# Altium project BMS Slave Device R1.5.PrjPcb
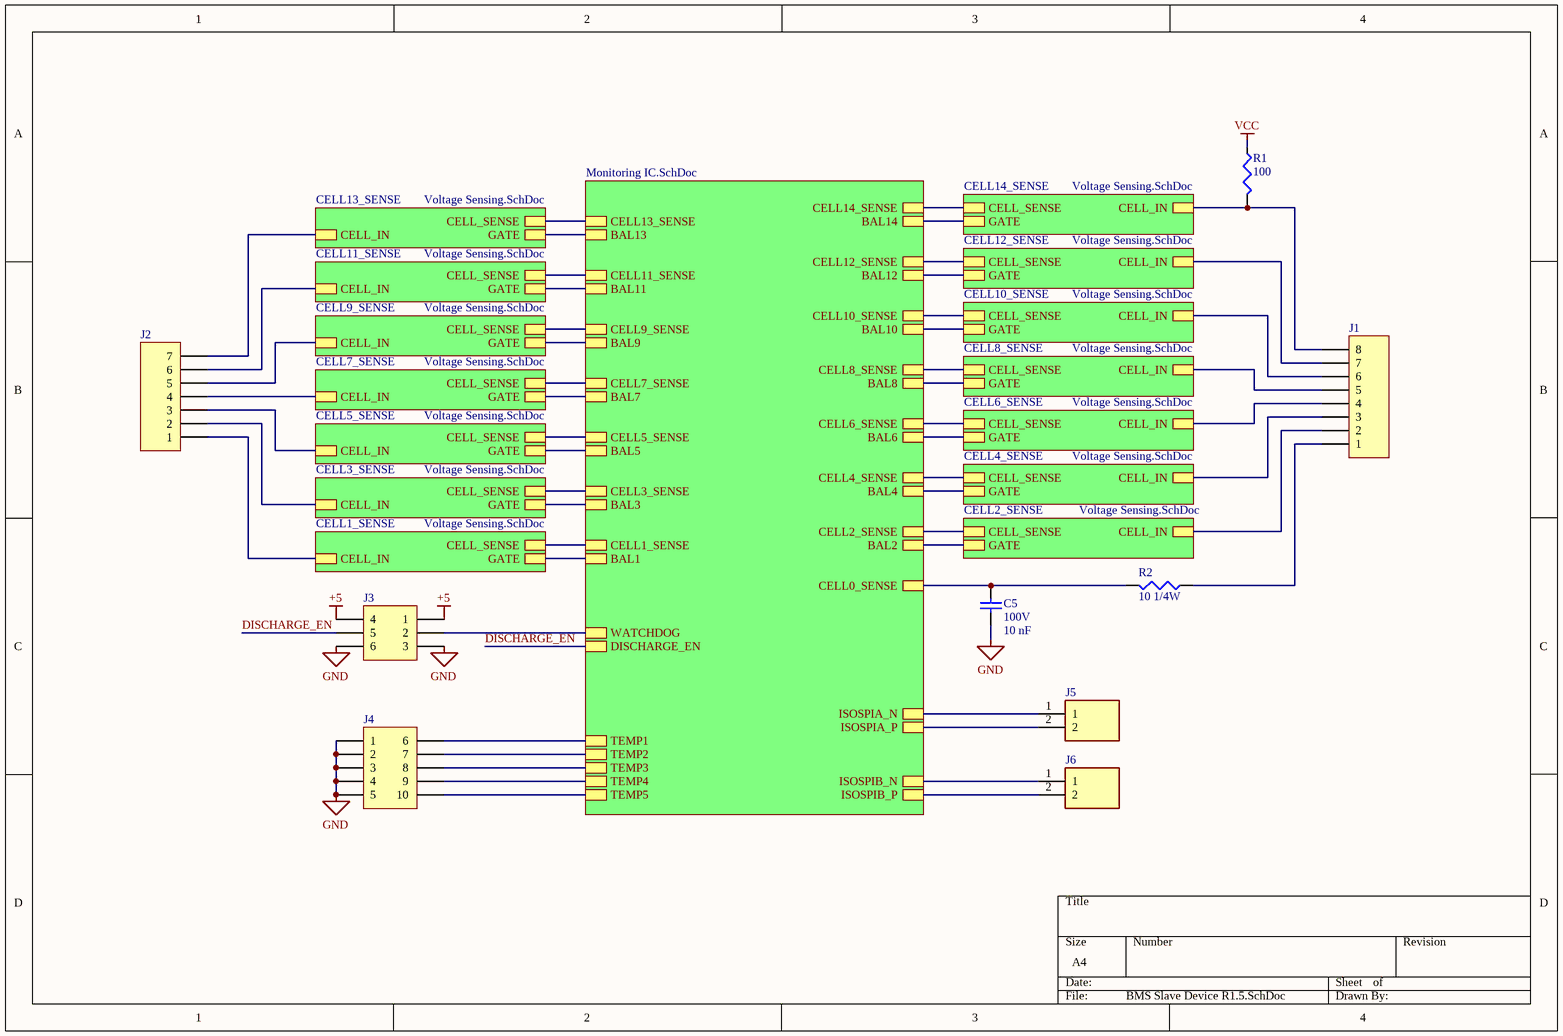
[diagram p0: BMS Slave Device R1.5.SchDoc]
3 sheets, 91 parts. Net scope: hierarchical (ports join the sheet entries above them; power ports are global).
Board file: BMS Slave Device R1.5.PcbDoc
Sheets:
  BMS Slave Device R1.5.SchDoc
    Designator = Monitoring IC.SchDoc
    CELL14_SENSE = Voltage Sensing.SchDoc
    CELL12_SENSE = Voltage Sensing.SchDoc
    CELL10_SENSE = Voltage Sensing.SchDoc
    CELL8_SENSE = Voltage Sensing.SchDoc
    CELL6_SENSE = Voltage Sensing.SchDoc
    CELL4_SENSE = Voltage Sensing.SchDoc
    CELL2_SENSE = Voltage Sensing.SchDoc
    CELL13_SENSE = Voltage Sensing.SchDoc
    CELL11_SENSE = Voltage Sensing.SchDoc
    CELL9_SENSE = Voltage Sensing.SchDoc
    CELL7_SENSE = Voltage Sensing.SchDoc
    CELL5_SENSE = Voltage Sensing.SchDoc
    CELL3_SENSE = Voltage Sensing.SchDoc
    CELL1_SENSE = Voltage Sensing.SchDoc

## Sheet BMS Slave Device R1.5.SchDoc
size A4

### Parts
C5  100V  100V: 10 nF  [6-0805_N]
J1  Header 8  [HDR1X8]  (value not drawn)
J2  ODD CELLS  [HDR1X7]  (value not drawn)
J3  (no value)  [HDR2X3_CEN]
J4  THERMISTORS  [HDR2X5_CEN]  (value not drawn)
J5  B2B-XH-2__LF__SN_  [B2BXH2LFSN]  (value not drawn)
J6  B2B-XH-2__LF__SN_  [B2BXH2LFSN]  (value not drawn)
R1  value 100  [J1-0603]  (hidden comment: Res3)
R2  value 10 1/4W  [C1206]

### Sub-sheets
CELL1_SENSE = Voltage Sensing.SchDoc: CELL_SENSE, CELL_IN, GATE
CELL2_SENSE = Voltage Sensing.SchDoc: CELL_SENSE, CELL_IN, GATE
CELL3_SENSE = Voltage Sensing.SchDoc: CELL_SENSE, CELL_IN, GATE
CELL4_SENSE = Voltage Sensing.SchDoc: CELL_SENSE, CELL_IN, GATE
CELL5_SENSE = Voltage Sensing.SchDoc: CELL_SENSE, CELL_IN, GATE
CELL6_SENSE = Voltage Sensing.SchDoc: CELL_SENSE, CELL_IN, GATE
CELL7_SENSE = Voltage Sensing.SchDoc: CELL_SENSE, CELL_IN, GATE
CELL8_SENSE = Voltage Sensing.SchDoc: CELL_SENSE, CELL_IN, GATE
CELL9_SENSE = Voltage Sensing.SchDoc: CELL_SENSE, CELL_IN, GATE
CELL10_SENSE = Voltage Sensing.SchDoc: CELL_SENSE, CELL_IN, GATE
CELL11_SENSE = Voltage Sensing.SchDoc: CELL_SENSE, CELL_IN, GATE
CELL12_SENSE = Voltage Sensing.SchDoc: CELL_SENSE, CELL_IN, GATE
CELL13_SENSE = Voltage Sensing.SchDoc: CELL_SENSE, CELL_IN, GATE
CELL14_SENSE = Voltage Sensing.SchDoc: CELL_SENSE, CELL_IN, GATE
Designator = Monitoring IC.SchDoc: CELL14_SENSE, BAL14, CELL13_SENSE, BAL13, CELL12_SENSE, BAL12, CELL11_SENSE, BAL11, CELL10_SENSE, BAL10, CELL9_SENSE, BAL9, CELL8_SENSE, BAL8, CELL7_SENSE, BAL7, CELL6_SENSE, BAL6, CELL5_SENSE, BAL5, CELL4_SENSE, BAL4, CELL3_SENSE, BAL3, BAL2, CELL2_SENSE, CELL1_SENSE, BAL1, TEMP3, TEMP4, TEMP2, TEMP1, TEMP5, CELL0_SENSE, WATCHDOG, DISCHARGE_EN, ISOSPIA_N, ISOSPIB_P, ISOSPIB_N, ISOSPIA_P

### Nets
+5: J3.1 J3.4
GND: C5.1 J3.3 J3.6 J4.1 J4.2 J4.3 J4.4 J4.5
VCC: R1.2
DISCHARGE_EN: J3.5 ; sheet Designator/DISCHARGE_EN
NetC4A_2: sheet Designator/CELL1_SENSE, sheet CELL1_SENSE/CELL_SENSE
NetC4B_2: sheet Designator/CELL2_SENSE, sheet CELL2_SENSE/CELL_SENSE
NetC4C_2: sheet Designator/CELL3_SENSE, sheet CELL3_SENSE/CELL_SENSE
NetC4D_2: sheet Designator/CELL4_SENSE, sheet CELL4_SENSE/CELL_SENSE
NetC4E_2: sheet Designator/CELL5_SENSE, sheet CELL5_SENSE/CELL_SENSE
NetC4F_2: sheet Designator/CELL6_SENSE, sheet CELL6_SENSE/CELL_SENSE
NetC4G_2: sheet Designator/CELL7_SENSE, sheet CELL7_SENSE/CELL_SENSE
NetC4H_2: sheet Designator/CELL8_SENSE, sheet CELL8_SENSE/CELL_SENSE
NetC4I_2: sheet Designator/CELL9_SENSE, sheet CELL9_SENSE/CELL_SENSE
NetC4J_2: sheet Designator/CELL10_SENSE, sheet CELL10_SENSE/CELL_SENSE
NetC4K_2: sheet Designator/CELL11_SENSE, sheet CELL11_SENSE/CELL_SENSE
NetC4L_2: sheet Designator/CELL12_SENSE, sheet CELL12_SENSE/CELL_SENSE
NetC4M_2: sheet Designator/CELL13_SENSE, sheet CELL13_SENSE/CELL_SENSE
NetC4N_2: sheet Designator/CELL14_SENSE, sheet CELL14_SENSE/CELL_SENSE
NetC5_2: C5.2 R2.1 ; sheet Designator/CELL0_SENSE
NetD1A_2: sheet Designator/BAL1, sheet CELL1_SENSE/GATE
NetD1B_2: sheet Designator/BAL2, sheet CELL2_SENSE/GATE
NetD1C_2: sheet Designator/BAL3, sheet CELL3_SENSE/GATE
NetD1D_2: sheet Designator/BAL4, sheet CELL4_SENSE/GATE
NetD1E_2: sheet Designator/BAL5, sheet CELL5_SENSE/GATE
NetD1F_2: sheet Designator/BAL6, sheet CELL6_SENSE/GATE
NetD1G_2: sheet Designator/BAL7, sheet CELL7_SENSE/GATE
NetD1H_2: sheet Designator/BAL8, sheet CELL8_SENSE/GATE
NetD1I_2: sheet Designator/BAL9, sheet CELL9_SENSE/GATE
NetD1J_2: sheet Designator/BAL10, sheet CELL10_SENSE/GATE
NetD1K_2: sheet Designator/BAL11, sheet CELL11_SENSE/GATE
NetD1L_2: sheet Designator/BAL12, sheet CELL12_SENSE/GATE
NetD1M_2: sheet Designator/BAL13, sheet CELL13_SENSE/GATE
NetD1N_2: sheet Designator/BAL14, sheet CELL14_SENSE/GATE
NetJ1_1: J1.1 R2.2
NetJ1_2: J1.2 ; sheet CELL2_SENSE/CELL_IN
NetJ1_3: J1.3 ; sheet CELL4_SENSE/CELL_IN
NetJ1_4: J1.4 ; sheet CELL6_SENSE/CELL_IN
NetJ1_5: J1.5 ; sheet CELL8_SENSE/CELL_IN
NetJ1_6: J1.6 ; sheet CELL10_SENSE/CELL_IN
NetJ1_7: J1.7 ; sheet CELL12_SENSE/CELL_IN
NetJ1_8: J1.8 R1.1 ; sheet CELL14_SENSE/CELL_IN
NetJ2_1: J2.1 ; sheet CELL1_SENSE/CELL_IN
NetJ2_2: J2.2 ; sheet CELL3_SENSE/CELL_IN
NetJ2_3: J2.3 ; sheet CELL5_SENSE/CELL_IN
NetJ2_4: J2.4 ; sheet CELL7_SENSE/CELL_IN
NetJ2_5: J2.5 ; sheet CELL9_SENSE/CELL_IN
NetJ2_6: J2.6 ; sheet CELL11_SENSE/CELL_IN
NetJ2_7: J2.7 ; sheet CELL13_SENSE/CELL_IN
NetJ3_2: J3.2 ; sheet Designator/WATCHDOG
NetJ4_6: J4.6 ; sheet Designator/TEMP1
NetJ4_7: J4.7 ; sheet Designator/TEMP2
NetJ4_8: J4.8 ; sheet Designator/TEMP3
NetJ4_9: J4.9 ; sheet Designator/TEMP4
NetJ4_10: J4.10 ; sheet Designator/TEMP5
NetJ5_1: J5.1 ; sheet Designator/ISOSPIA_N
NetJ5_2: J5.2 ; sheet Designator/ISOSPIA_P
NetJ6_1: J6.1 ; sheet Designator/ISOSPIB_N
NetJ6_2: J6.2 ; sheet Designator/ISOSPIB_P

### Library data of the parts
C5 = Cap: Capacitor; Published: 8-Jun-2000; LatestRevisionDate: 17-Jul-2002; LatestRevisionNote: Re-released for DXP Platform.; PackageReference: RAD-0.3; Publisher: Altium Limited; PackageDescription: Radial Cap, Thru-Hole; 2 Leads; 0.3 in Pin Spacing
J1 = Header 8: Header, 8-Pin; LatestRevisionDate: 17-Jul-2002; LatestRevisionNote: Re-released for DXP Platform.; Publisher: Altium Limited
J2 = Header 7: LatestRevisionDate: 17-Jul-2002; LatestRevisionNote: Re-released for DXP Platform.; Publisher: Altium Limited
J3 = Header 3X2A: Header, 3-Pin, Dual row; LatestRevisionDate: 17-Jul-2002; LatestRevisionNote: Re-released for DXP Platform.; Publisher: Altium Limited
J4 = Header 5X2A: Header, 5-Pin, Dual row; LatestRevisionDate: 17-Jul-2002; LatestRevisionNote: Re-released for DXP Platform.; Publisher: Altium Limited
J5 J6 = B2B-XH-2__LF__SN_: Connector; Manufacturer_Name: JST (JAPAN SOLDERLESS TERMINALS); Manufacturer_Part_Number: B2B-XH-2 (LF)(SN); Datasheet Link: http://uk.rs-online.com/web/p/products/1755297; Height: 7mm; RS Part Number: 1755499; RS Price/Stock: http://uk.rs-online.com/web/p/products/1755499
R1 R2 = Res3: Resistor; Published: 8-Jun-2000; LatestRevisionDate: 29-May-2009; LatestRevisionNote: IPC-7351 Footprint Added.; PackageReference: J1-0603; Publisher: Altium Limited; PackageDescription: Chip Resistor

## Sheet Monitoring IC.SchDoc
size A4
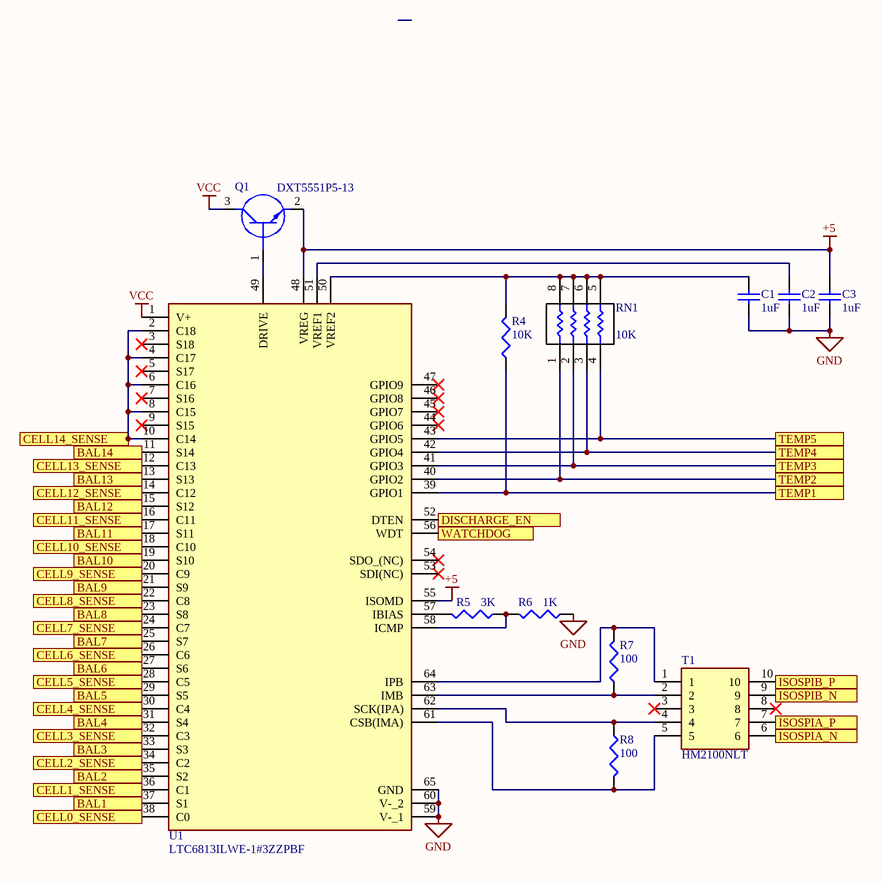
[diagram p1: Monitoring IC.SchDoc]

### Parts
C1  value 1uF  [6-0805_N]  (hidden comment: Cap)
C2  value 1uF  [6-0805_N]  (hidden comment: Cap)
C3  value 1uF  [6-0805_N]  (hidden comment: Cap)
Q1  DXT5551P5-13  [DXT5551P513]
R4  value 10K  [J1-0603]  (hidden comment: Res3)
R5  value 3K  [J1-0603]  (hidden comment: Res3)
R6  value 1K  [J1-0603]  (hidden comment: Res3)
R7  value 100  [J1-0603]  (hidden comment: Res3)
R8  value 100  [J1-0603]  (hidden comment: Res3)
RN1  value 10K  [YC164]  (hidden comment: Res Array)
T1  HM2100NLT  [HM2100NLT]
U1  LTC6813ILWE-1#3ZZPBF  [QFP50P1200X1200X120-65N]

### Ports
BAL1, BAL2, BAL3, BAL4, BAL5, BAL6, BAL7, BAL8, BAL9, BAL10, BAL11, BAL12, BAL13, BAL14, CELL0_SENSE, CELL1_SENSE, CELL2_SENSE, CELL3_SENSE, CELL4_SENSE, CELL5_SENSE, CELL6_SENSE, CELL7_SENSE, CELL8_SENSE, CELL9_SENSE, CELL10_SENSE, CELL11_SENSE, CELL12_SENSE, CELL13_SENSE, CELL14_SENSE, DISCHARGE_EN, ISOSPIA_N, ISOSPIA_P, ISOSPIB_N, ISOSPIB_P, TEMP1, TEMP2, TEMP3, TEMP4, TEMP5, WATCHDOG

### Nets
+5: C3.2 Q1.2(E) U1.48(VREG) U1.55(ISOMD)
GND: C1.1 C2.1 C3.1 R6.1 U1.59(V-_1) U1.60(V-_2) U1.65(GND)
VCC: Q1.3(C) U1.1(V+)
DISCHARGE_EN: U1.52(DTEN) ; port DISCHARGE_EN
NetC1_2: C1.2 R4.2 RN1.5 RN1.6 RN1.7 RN1.8 U1.50(VREF2)
NetC2_2: C2.2 U1.51(VREF1)
NetC4A_2: U1.36(C1) ; port CELL1_SENSE
NetC4B_2: U1.34(C2) ; port CELL2_SENSE
NetC4C_2: U1.32(C3) ; port CELL3_SENSE
NetC4D_2: U1.30(C4) ; port CELL4_SENSE
NetC4E_2: U1.28(C5) ; port CELL5_SENSE
NetC4F_2: U1.26(C6) ; port CELL6_SENSE
NetC4G_2: U1.24(C7) ; port CELL7_SENSE
NetC4H_2: U1.22(C8) ; port CELL8_SENSE
NetC4I_2: U1.20(C9) ; port CELL9_SENSE
NetC4J_2: U1.18(C10) ; port CELL10_SENSE
NetC4K_2: U1.16(C11) ; port CELL11_SENSE
NetC4L_2: U1.14(C12) ; port CELL12_SENSE
NetC4M_2: U1.12(C13) ; port CELL13_SENSE
NetC4N_2: U1.2(C18) U1.4(C17) U1.6(C16) U1.8(C15) U1.10(C14) ; port CELL14_SENSE
NetC5_2: U1.38(C0) ; port CELL0_SENSE
NetD1A_2: U1.37(S1) ; port BAL1
NetD1B_2: U1.35(S2) ; port BAL2
NetD1C_2: U1.33(S3) ; port BAL3
NetD1D_2: U1.31(S4) ; port BAL4
NetD1E_2: U1.29(S5) ; port BAL5
NetD1F_2: U1.27(S6) ; port BAL6
NetD1G_2: U1.25(S7) ; port BAL7
NetD1H_2: U1.23(S8) ; port BAL8
NetD1I_2: U1.21(S9) ; port BAL9
NetD1J_2: U1.19(S10) ; port BAL10
NetD1K_2: U1.17(S11) ; port BAL11
NetD1L_2: U1.15(S12) ; port BAL12
NetD1M_2: U1.13(S13) ; port BAL13
NetD1N_2: U1.11(S14) ; port BAL14
NetJ3_2: U1.56(WDT) ; port WATCHDOG
NetJ4_6: R4.1 U1.39(GPIO1) ; port TEMP1
NetJ4_7: RN1.1 U1.40(GPIO2) ; port TEMP2
NetJ4_8: RN1.2 U1.41(GPIO3) ; port TEMP3
NetJ4_9: RN1.3 U1.42(GPIO4) ; port TEMP4
NetJ4_10: RN1.4 U1.43(GPIO5) ; port TEMP5
NetJ5_1: T1.6 ; port ISOSPIA_N
NetJ5_2: T1.7 ; port ISOSPIA_P
NetJ6_1: T1.9 ; port ISOSPIB_N
NetJ6_2: T1.10 ; port ISOSPIB_P
NetQ1_1: Q1.1(B) U1.49(DRIVE)
NetR5_1: R5.1 R6.2 U1.58(ICMP)
NetR5_2: R5.2 U1.57(IBIAS)
NetR7_1: R7.1 T1.2 U1.63(IMB)
NetR7_2: R7.2 T1.1 U1.64(IPB)
NetR8_1: R8.1 T1.4 U1.62(SCK(IPA))
NetR8_2: R8.2 T1.5 U1.61(CSB(IMA))

Not connected (* = marked no-connect by the designer): T1 3* 8*; U1 3(S18)* 5(S17)* 7(S16)* 9(S15)* 44(GPIO6)* 45(GPIO7)* 46(GPIO8)* 47(GPIO9)* 53(SDI(NC))* 54(SDO_(NC))*

### Library data of the parts
C1-C3 = Cap: Capacitor; Published: 8-Jun-2000; LatestRevisionDate: 17-Jul-2002; LatestRevisionNote: Re-released for DXP Platform.; PackageReference: RAD-0.3; Publisher: Altium Limited; PackageDescription: Radial Cap, Thru-Hole; 2 Leads; 0.3 in Pin Spacing
Q1 = DXT5551P5-13: Transistor BJT NPN; Manufacturer_Name: Diodes Inc.; Datasheet Link: https://www.diodes.com/assets/Datasheets/DXT5551P5.pdf; Manufacturer_Part_Number: DXT5551P5-13; Mouser Part Number: 522-DXT5551P5-13; Mouser Price/Stock: https://www.mouser.com/Search/Refine.aspx?Keyword=522-DXT5551P5-13
R4-R8 = Res3: Resistor; Published: 8-Jun-2000; LatestRevisionDate: 29-May-2009; LatestRevisionNote: IPC-7351 Footprint Added.; PackageReference: J1-0603; Publisher: Altium Limited; PackageDescription: Chip Resistor
RN1 = Res Array: Isolated Resistor Network; Published: 24-Mar-1999; LatestRevisionDate: 29-May-2009; LatestRevisionNote: IPC-7351 Footprint Added.; PackageReference: SO-16; Publisher: Altium Limited; PackageDescription: 16-Pin Small Outline Integrated Circuit 1.27 mm Pitch; Code_JEDEC: MS-012-AC; Code_IPC: SOIC127P600-16
T1 = HM2100NLT: Transformer; Manufacturer_Name: Pulse; Datasheet Link: https://productfinder.pulseeng.com/doc_type/WEB301/doc_num/HM2100NL/doc_part/HM2100NL.pdf; Height: 3.45mm; Manufacturer_Part_Number: HM2100NLT; Mouser Part Number: 673-HM2100NLT; Mouser Price/Stock: https://www.mouser.com/Search/Refine.aspx?Keyword=673-HM2100NLT
U1 = LTC6813ILWE-1#3ZZPBF: Integrated Circuit; Manufacturer_Name: Analog Devices; Datasheet Link: https://www.analog.com/media/en/technical-documentation/data-sheets/68131f.pdf; Height: 1.6mm; Manufacturer_Part_Number: LTC6813ILWE-1#3ZZPBF; Mouser Part Number: 584-6813ILWE13ZZPBF

## Sheet Voltage Sensing.SchDoc
size A4
Used 14 times, as channels CELL14_SENSE, CELL12_SENSE, CELL10_SENSE, CELL8_SENSE, CELL6_SENSE, CELL4_SENSE, CELL2_SENSE, CELL13_SENSE, CELL11_SENSE, CELL9_SENSE, CELL7_SENSE, CELL5_SENSE, CELL3_SENSE, CELL1_SENSE. Parts and nets are listed once, with the designators drawn on the sheet.
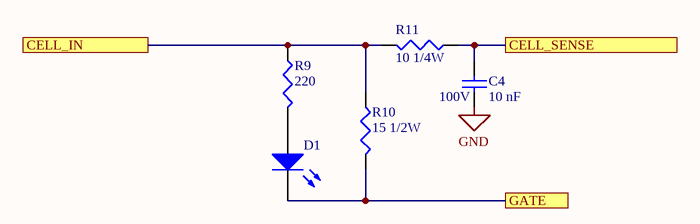
[diagram p2: Voltage Sensing.SchDoc]

### Parts
C4  100V  100V: 10 nF  [6-0805_N]
D1  LED2  [DIOC1608X06N]  (value not drawn)
R9  value 220  [J1-0603]  (hidden comment: Res3)
R10  value 15 1/2W  [14-1210]  (hidden comment: Res3)
R11  value 10 1/4W  [C1206]

### Ports
CELL_IN, CELL_SENSE, GATE

### Nets
GND: C4.1
CELL_IN: R9.1 R10.1 R11.2 ; port CELL_IN
CELL_SENSE: C4.2 R11.1 ; port CELL_SENSE
GATE: D1.2(K) R10.2 ; port GATE
NetD1_1: D1.1(A) R9.2

### Channels
CELL14_SENSE: designators end in N; ports CELL_IN=NetJ1_8 CELL_SENSE=NetC4N_2 GATE=NetD1N_2
CELL12_SENSE: designators end in L; ports CELL_IN=NetJ1_7 CELL_SENSE=NetC4L_2 GATE=NetD1L_2
CELL10_SENSE: designators end in J; ports CELL_IN=NetJ1_6 CELL_SENSE=NetC4J_2 GATE=NetD1J_2
CELL8_SENSE: designators end in H; ports CELL_IN=NetJ1_5 CELL_SENSE=NetC4H_2 GATE=NetD1H_2
CELL6_SENSE: designators end in F; ports CELL_IN=NetJ1_4 CELL_SENSE=NetC4F_2 GATE=NetD1F_2
CELL4_SENSE: designators end in D; ports CELL_IN=NetJ1_3 CELL_SENSE=NetC4D_2 GATE=NetD1D_2
CELL2_SENSE: designators end in B; ports CELL_IN=NetJ1_2 CELL_SENSE=NetC4B_2 GATE=NetD1B_2
CELL13_SENSE: designators end in M; ports CELL_IN=NetJ2_7 CELL_SENSE=NetC4M_2 GATE=NetD1M_2
CELL11_SENSE: designators end in K; ports CELL_IN=NetJ2_6 CELL_SENSE=NetC4K_2 GATE=NetD1K_2
CELL9_SENSE: designators end in I; ports CELL_IN=NetJ2_5 CELL_SENSE=NetC4I_2 GATE=NetD1I_2
CELL7_SENSE: designators end in G; ports CELL_IN=NetJ2_4 CELL_SENSE=NetC4G_2 GATE=NetD1G_2
CELL5_SENSE: designators end in E; ports CELL_IN=NetJ2_3 CELL_SENSE=NetC4E_2 GATE=NetD1E_2
CELL3_SENSE: designators end in C; ports CELL_IN=NetJ2_2 CELL_SENSE=NetC4C_2 GATE=NetD1C_2
CELL1_SENSE: designators end in A; ports CELL_IN=NetJ2_1 CELL_SENSE=NetC4A_2 GATE=NetD1A_2

### Library data of the parts
C4 = Cap: Capacitor; Published: 8-Jun-2000; LatestRevisionDate: 17-Jul-2002; LatestRevisionNote: Re-released for DXP Platform.; PackageReference: RAD-0.3; Publisher: Altium Limited; PackageDescription: Radial Cap, Thru-Hole; 2 Leads; 0.3 in Pin Spacing
D1 = LED2: Green LED; Published: 8-Jun-2000; LatestRevisionDate: 17-Jul-2002; LatestRevisionNote: Re-released for DXP Platform.; PackageVersion: Feb-2002; PackageReference: 3.2X1.6X1.1; Publisher: Altium Limited; PackageDescription: SM LED; 2 Flat Leads
R9-R11 = Res3: Resistor; Published: 8-Jun-2000; LatestRevisionDate: 29-May-2009; LatestRevisionNote: IPC-7351 Footprint Added.; PackageReference: J1-0603; Publisher: Altium Limited; PackageDescription: Chip Resistor

## Nets that join several sheets
+5: BMS Slave Device R1.5 (J3.1 J3.4), Monitoring IC (C3.2 Q1.2 U1.48 U1.55)
GND: BMS Slave Device R1.5 (8 pins), Monitoring IC (7 pins), CELL14_SENSE (C4N.1), CELL12_SENSE (C4L.1), CELL10_SENSE (C4J.1), CELL8_SENSE (C4H.1), CELL6_SENSE (C4F.1), CELL4_SENSE (C4D.1), CELL2_SENSE (C4B.1), CELL13_SENSE (C4M.1), CELL11_SENSE (C4K.1), CELL9_SENSE (C4I.1), CELL7_SENSE (C4G.1), CELL5_SENSE (C4E.1), CELL3_SENSE (C4C.1), CELL1_SENSE (C4A.1)
VCC: BMS Slave Device R1.5 (R1.2), Monitoring IC (Q1.3 U1.1)
DISCHARGE_EN: BMS Slave Device R1.5 (J3.5), Monitoring IC (U1.52)
NetC4A_2: Monitoring IC (U1.36), CELL1_SENSE (C4A.2 R11A.1)
NetC4B_2: Monitoring IC (U1.34), CELL2_SENSE (C4B.2 R11B.1)
NetC4C_2: Monitoring IC (U1.32), CELL3_SENSE (C4C.2 R11C.1)
NetC4D_2: Monitoring IC (U1.30), CELL4_SENSE (C4D.2 R11D.1)
NetC4E_2: Monitoring IC (U1.28), CELL5_SENSE (C4E.2 R11E.1)
NetC4F_2: Monitoring IC (U1.26), CELL6_SENSE (C4F.2 R11F.1)
NetC4G_2: Monitoring IC (U1.24), CELL7_SENSE (C4G.2 R11G.1)
NetC4H_2: Monitoring IC (U1.22), CELL8_SENSE (C4H.2 R11H.1)
NetC4I_2: Monitoring IC (U1.20), CELL9_SENSE (C4I.2 R11I.1)
NetC4J_2: Monitoring IC (U1.18), CELL10_SENSE (C4J.2 R11J.1)
NetC4K_2: Monitoring IC (U1.16), CELL11_SENSE (C4K.2 R11K.1)
NetC4L_2: Monitoring IC (U1.14), CELL12_SENSE (C4L.2 R11L.1)
NetC4M_2: Monitoring IC (U1.12), CELL13_SENSE (C4M.2 R11M.1)
NetC4N_2: Monitoring IC (5 pins), CELL14_SENSE (C4N.2 R11N.1)
NetC5_2: BMS Slave Device R1.5 (C5.2 R2.1), Monitoring IC (U1.38)
NetD1A_2: Monitoring IC (U1.37), CELL1_SENSE (D1A.2 R10A.2)
NetD1B_2: Monitoring IC (U1.35), CELL2_SENSE (D1B.2 R10B.2)
NetD1C_2: Monitoring IC (U1.33), CELL3_SENSE (D1C.2 R10C.2)
NetD1D_2: Monitoring IC (U1.31), CELL4_SENSE (D1D.2 R10D.2)
NetD1E_2: Monitoring IC (U1.29), CELL5_SENSE (D1E.2 R10E.2)
NetD1F_2: Monitoring IC (U1.27), CELL6_SENSE (D1F.2 R10F.2)
NetD1G_2: Monitoring IC (U1.25), CELL7_SENSE (D1G.2 R10G.2)
NetD1H_2: Monitoring IC (U1.23), CELL8_SENSE (D1H.2 R10H.2)
NetD1I_2: Monitoring IC (U1.21), CELL9_SENSE (D1I.2 R10I.2)
NetD1J_2: Monitoring IC (U1.19), CELL10_SENSE (D1J.2 R10J.2)
NetD1K_2: Monitoring IC (U1.17), CELL11_SENSE (D1K.2 R10K.2)
NetD1L_2: Monitoring IC (U1.15), CELL12_SENSE (D1L.2 R10L.2)
NetD1M_2: Monitoring IC (U1.13), CELL13_SENSE (D1M.2 R10M.2)
NetD1N_2: Monitoring IC (U1.11), CELL14_SENSE (D1N.2 R10N.2)
NetJ1_2: BMS Slave Device R1.5 (J1.2), CELL2_SENSE (R9B.1 R10B.1 R11B.2)
NetJ1_3: BMS Slave Device R1.5 (J1.3), CELL4_SENSE (R9D.1 R10D.1 R11D.2)
NetJ1_4: BMS Slave Device R1.5 (J1.4), CELL6_SENSE (R9F.1 R10F.1 R11F.2)
NetJ1_5: BMS Slave Device R1.5 (J1.5), CELL8_SENSE (R9H.1 R10H.1 R11H.2)
NetJ1_6: BMS Slave Device R1.5 (J1.6), CELL10_SENSE (R9J.1 R10J.1 R11J.2)
NetJ1_7: BMS Slave Device R1.5 (J1.7), CELL12_SENSE (R9L.1 R10L.1 R11L.2)
NetJ1_8: BMS Slave Device R1.5 (J1.8 R1.1), CELL14_SENSE (R9N.1 R10N.1 R11N.2)
NetJ2_1: BMS Slave Device R1.5 (J2.1), CELL1_SENSE (R9A.1 R10A.1 R11A.2)
NetJ2_2: BMS Slave Device R1.5 (J2.2), CELL3_SENSE (R9C.1 R10C.1 R11C.2)
NetJ2_3: BMS Slave Device R1.5 (J2.3), CELL5_SENSE (R9E.1 R10E.1 R11E.2)
NetJ2_4: BMS Slave Device R1.5 (J2.4), CELL7_SENSE (R9G.1 R10G.1 R11G.2)
NetJ2_5: BMS Slave Device R1.5 (J2.5), CELL9_SENSE (R9I.1 R10I.1 R11I.2)
NetJ2_6: BMS Slave Device R1.5 (J2.6), CELL11_SENSE (R9K.1 R10K.1 R11K.2)
NetJ2_7: BMS Slave Device R1.5 (J2.7), CELL13_SENSE (R9M.1 R10M.1 R11M.2)
NetJ3_2: BMS Slave Device R1.5 (J3.2), Monitoring IC (U1.56)
NetJ4_6: BMS Slave Device R1.5 (J4.6), Monitoring IC (R4.1 U1.39)
NetJ4_7: BMS Slave Device R1.5 (J4.7), Monitoring IC (RN1.1 U1.40)
NetJ4_8: BMS Slave Device R1.5 (J4.8), Monitoring IC (RN1.2 U1.41)
NetJ4_9: BMS Slave Device R1.5 (J4.9), Monitoring IC (RN1.3 U1.42)
NetJ4_10: BMS Slave Device R1.5 (J4.10), Monitoring IC (RN1.4 U1.43)
NetJ5_1: BMS Slave Device R1.5 (J5.1), Monitoring IC (T1.6)
NetJ5_2: BMS Slave Device R1.5 (J5.2), Monitoring IC (T1.7)
NetJ6_1: BMS Slave Device R1.5 (J6.1), Monitoring IC (T1.9)
NetJ6_2: BMS Slave Device R1.5 (J6.2), Monitoring IC (T1.10)